# Altium project RightHand.PrjPcb (part 2 of 3)
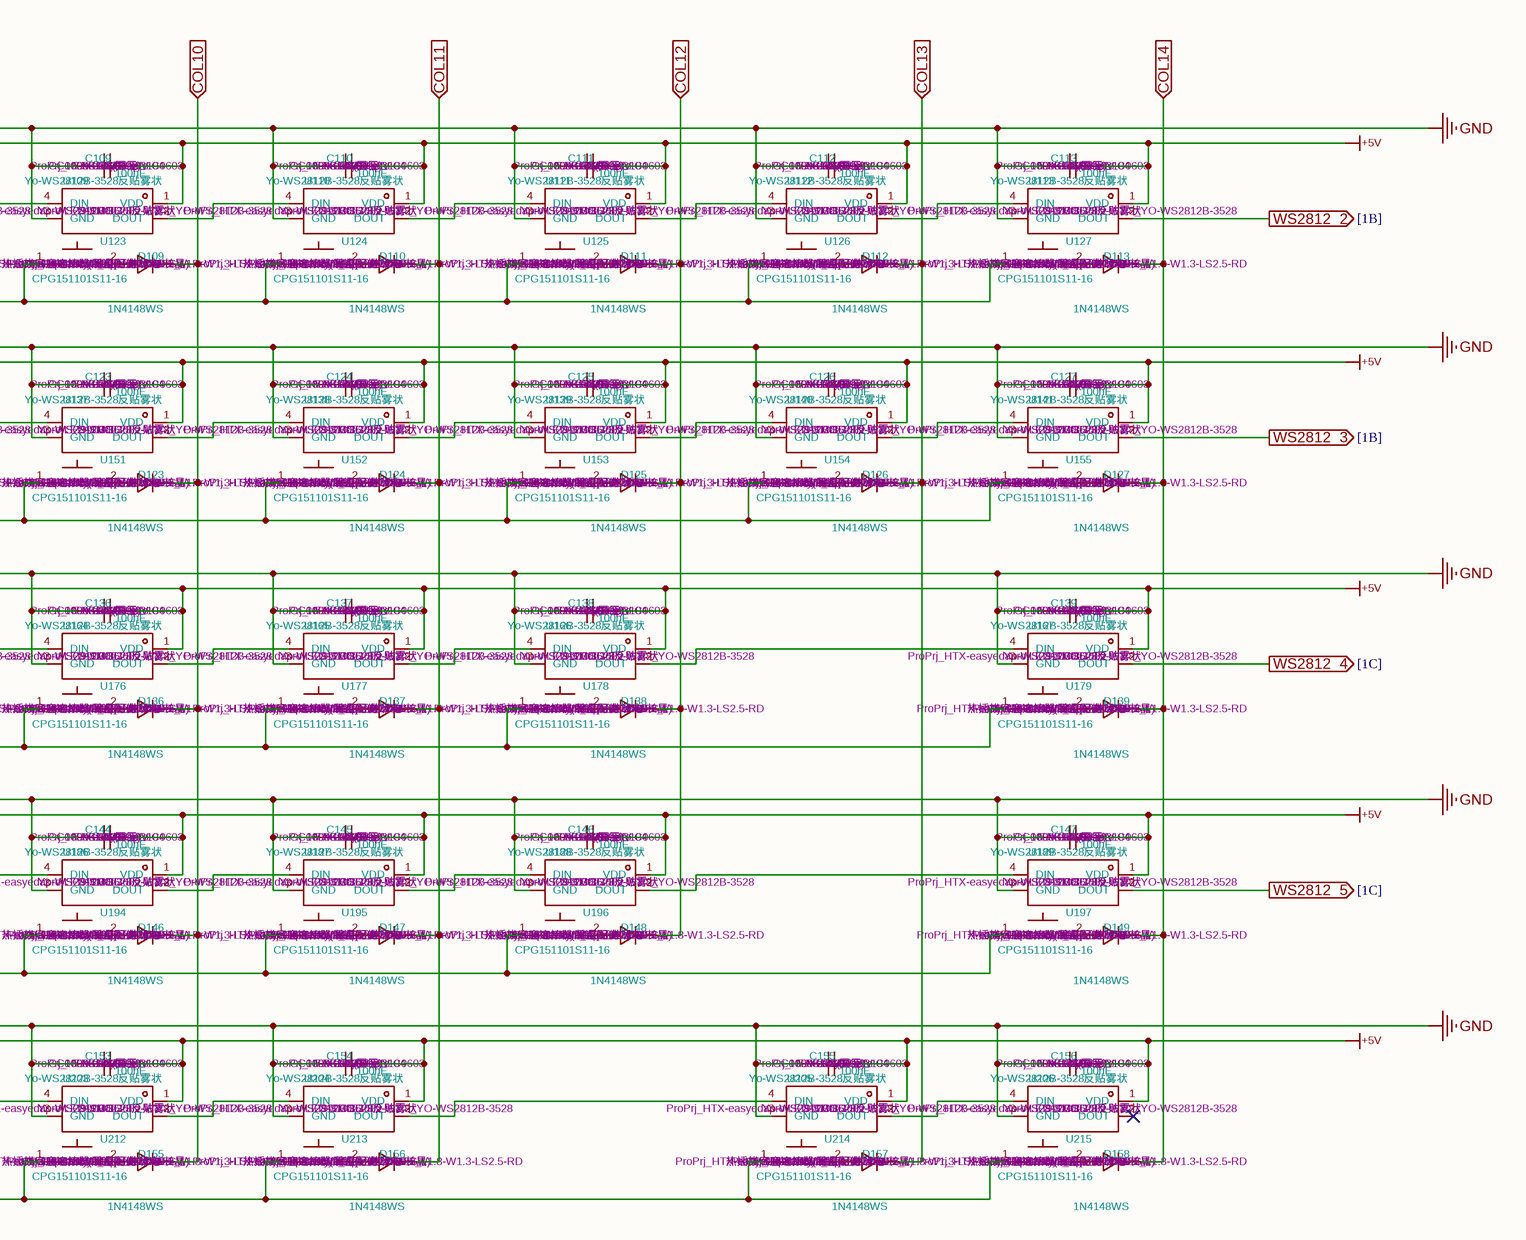
[diagram p10: 2_keys.SchDoc, right]

## Sheet 2_keys.SchDoc (continued)

### Parts
C100  Manufacturer: YAGEO(国巨)  Supplier Part: C14663  Supplier: LCSC  LCSC Part Name: 100nF ±10% 50V  Footprint: ProPrj_HTX-easyedapro:C0603  [C0603]  (hidden comment: 100nF)
C101  Manufacturer: YAGEO(国巨)  Supplier Part: C14663  Supplier: LCSC  LCSC Part Name: 100nF ±10% 50V  Footprint: ProPrj_HTX-easyedapro:C0603  [C0603]  (hidden comment: 100nF)
C102  Manufacturer: YAGEO(国巨)  Supplier Part: C14663  Supplier: LCSC  LCSC Part Name: 100nF ±10% 50V  Footprint: ProPrj_HTX-easyedapro:C0603  [C0603]  (hidden comment: 100nF)
C103  Manufacturer: YAGEO(国巨)  Supplier Part: C14663  Supplier: LCSC  LCSC Part Name: 100nF ±10% 50V  Footprint: ProPrj_HTX-easyedapro:C0603  [C0603]  (hidden comment: 100nF)
C104  Manufacturer: YAGEO(国巨)  Supplier Part: C14663  Supplier: LCSC  LCSC Part Name: 100nF ±10% 50V  Footprint: ProPrj_HTX-easyedapro:C0603  [C0603]  (hidden comment: 100nF)
C105  Manufacturer: YAGEO(国巨)  Supplier Part: C14663  Supplier: LCSC  LCSC Part Name: 100nF ±10% 50V  Footprint: ProPrj_HTX-easyedapro:C0603  [C0603]  (hidden comment: 100nF)
C106  Manufacturer: YAGEO(国巨)  Supplier Part: C14663  Supplier: LCSC  LCSC Part Name: 100nF ±10% 50V  Footprint: ProPrj_HTX-easyedapro:C0603  [C0603]  (hidden comment: 100nF)
C107  Manufacturer: YAGEO(国巨)  Supplier Part: C14663  Supplier: LCSC  LCSC Part Name: 100nF ±10% 50V  Footprint: ProPrj_HTX-easyedapro:C0603  [C0603]  (hidden comment: 100nF)
C108  Manufacturer: YAGEO(国巨)  Supplier Part: C14663  Supplier: LCSC  LCSC Part Name: 100nF ±10% 50V  Footprint: ProPrj_HTX-easyedapro:C0603  [C0603]  (hidden comment: 100nF)
C109  Manufacturer: YAGEO(国巨)  Supplier Part: C14663  Supplier: LCSC  LCSC Part Name: 100nF ±10% 50V  Footprint: ProPrj_HTX-easyedapro:C0603  [C0603]  (hidden comment: 100nF)
C110  Manufacturer: YAGEO(国巨)  Supplier Part: C14663  Supplier: LCSC  LCSC Part Name: 100nF ±10% 50V  Footprint: ProPrj_HTX-easyedapro:C0603  [C0603]  (hidden comment: 100nF)
C111  Manufacturer: YAGEO(国巨)  Supplier Part: C14663  Supplier: LCSC  LCSC Part Name: 100nF ±10% 50V  Footprint: ProPrj_HTX-easyedapro:C0603  [C0603]  (hidden comment: 100nF)
C112  Manufacturer: YAGEO(国巨)  Supplier Part: C14663  Supplier: LCSC  LCSC Part Name: 100nF ±10% 50V  Footprint: ProPrj_HTX-easyedapro:C0603  [C0603]  (hidden comment: 100nF)
C113  Manufacturer: YAGEO(国巨)  Supplier Part: C14663  Supplier: LCSC  LCSC Part Name: 100nF ±10% 50V  Footprint: ProPrj_HTX-easyedapro:C0603  [C0603]  (hidden comment: 100nF)
C114  Manufacturer: YAGEO(国巨)  Supplier Part: C14663  Supplier: LCSC  LCSC Part Name: 100nF ±10% 50V  Footprint: ProPrj_HTX-easyedapro:C0603  [C0603]  (hidden comment: 100nF)
C115  Manufacturer: YAGEO(国巨)  Supplier Part: C14663  Supplier: LCSC  LCSC Part Name: 100nF ±10% 50V  Footprint: ProPrj_HTX-easyedapro:C0603  [C0603]  (hidden comment: 100nF)
C116  Manufacturer: YAGEO(国巨)  Supplier Part: C14663  Supplier: LCSC  LCSC Part Name: 100nF ±10% 50V  Footprint: ProPrj_HTX-easyedapro:C0603  [C0603]  (hidden comment: 100nF)
C117  Manufacturer: YAGEO(国巨)  Supplier Part: C14663  Supplier: LCSC  LCSC Part Name: 100nF ±10% 50V  Footprint: ProPrj_HTX-easyedapro:C0603  [C0603]  (hidden comment: 100nF)
C118  Manufacturer: YAGEO(国巨)  Supplier Part: C14663  Supplier: LCSC  LCSC Part Name: 100nF ±10% 50V  Footprint: ProPrj_HTX-easyedapro:C0603  [C0603]  (hidden comment: 100nF)
C119  Manufacturer: YAGEO(国巨)  Supplier Part: C14663  Supplier: LCSC  LCSC Part Name: 100nF ±10% 50V  Footprint: ProPrj_HTX-easyedapro:C0603  [C0603]  (hidden comment: 100nF)
C120  Manufacturer: YAGEO(国巨)  Supplier Part: C14663  Supplier: LCSC  LCSC Part Name: 100nF ±10% 50V  Footprint: ProPrj_HTX-easyedapro:C0603  [C0603]  (hidden comment: 100nF)
C121  Manufacturer: YAGEO(国巨)  Supplier Part: C14663  Supplier: LCSC  LCSC Part Name: 100nF ±10% 50V  Footprint: ProPrj_HTX-easyedapro:C0603  [C0603]  (hidden comment: 100nF)
C122  Manufacturer: YAGEO(国巨)  Supplier Part: C14663  Supplier: LCSC  LCSC Part Name: 100nF ±10% 50V  Footprint: ProPrj_HTX-easyedapro:C0603  [C0603]  (hidden comment: 100nF)
C123  Manufacturer: YAGEO(国巨)  Supplier Part: C14663  Supplier: LCSC  LCSC Part Name: 100nF ±10% 50V  Footprint: ProPrj_HTX-easyedapro:C0603  [C0603]  (hidden comment: 100nF)
C124  Manufacturer: YAGEO(国巨)  Supplier Part: C14663  Supplier: LCSC  LCSC Part Name: 100nF ±10% 50V  Footprint: ProPrj_HTX-easyedapro:C0603  [C0603]  (hidden comment: 100nF)
C125  Manufacturer: YAGEO(国巨)  Supplier Part: C14663  Supplier: LCSC  LCSC Part Name: 100nF ±10% 50V  Footprint: ProPrj_HTX-easyedapro:C0603  [C0603]  (hidden comment: 100nF)
C126  Manufacturer: YAGEO(国巨)  Supplier Part: C14663  Supplier: LCSC  LCSC Part Name: 100nF ±10% 50V  Footprint: ProPrj_HTX-easyedapro:C0603  [C0603]  (hidden comment: 100nF)
C127  Manufacturer: YAGEO(国巨)  Supplier Part: C14663  Supplier: LCSC  LCSC Part Name: 100nF ±10% 50V  Footprint: ProPrj_HTX-easyedapro:C0603  [C0603]  (hidden comment: 100nF)
C128  Manufacturer: YAGEO(国巨)  Supplier Part: C14663  Supplier: LCSC  LCSC Part Name: 100nF ±10% 50V  Footprint: ProPrj_HTX-easyedapro:C0603  [C0603]  (hidden comment: 100nF)
C129  Manufacturer: YAGEO(国巨)  Supplier Part: C14663  Supplier: LCSC  LCSC Part Name: 100nF ±10% 50V  Footprint: ProPrj_HTX-easyedapro:C0603  [C0603]  (hidden comment: 100nF)
C130  Manufacturer: YAGEO(国巨)  Supplier Part: C14663  Supplier: LCSC  LCSC Part Name: 100nF ±10% 50V  Footprint: ProPrj_HTX-easyedapro:C0603  [C0603]  (hidden comment: 100nF)
C131  Manufacturer: YAGEO(国巨)  Supplier Part: C14663  Supplier: LCSC  LCSC Part Name: 100nF ±10% 50V  Footprint: ProPrj_HTX-easyedapro:C0603  [C0603]  (hidden comment: 100nF)
C132  Manufacturer: YAGEO(国巨)  Supplier Part: C14663  Supplier: LCSC  LCSC Part Name: 100nF ±10% 50V  Footprint: ProPrj_HTX-easyedapro:C0603  [C0603]  (hidden comment: 100nF)
C133  Manufacturer: YAGEO(国巨)  Supplier Part: C14663  Supplier: LCSC  LCSC Part Name: 100nF ±10% 50V  Footprint: ProPrj_HTX-easyedapro:C0603  [C0603]  (hidden comment: 100nF)
C134  Manufacturer: YAGEO(国巨)  Supplier Part: C14663  Supplier: LCSC  LCSC Part Name: 100nF ±10% 50V  Footprint: ProPrj_HTX-easyedapro:C0603  [C0603]  (hidden comment: 100nF)
C135  Manufacturer: YAGEO(国巨)  Supplier Part: C14663  Supplier: LCSC  LCSC Part Name: 100nF ±10% 50V  Footprint: ProPrj_HTX-easyedapro:C0603  [C0603]  (hidden comment: 100nF)
C136  Manufacturer: YAGEO(国巨)  Supplier Part: C14663  Supplier: LCSC  LCSC Part Name: 100nF ±10% 50V  Footprint: ProPrj_HTX-easyedapro:C0603  [C0603]  (hidden comment: 100nF)
C137  Manufacturer: YAGEO(国巨)  Supplier Part: C14663  Supplier: LCSC  LCSC Part Name: 100nF ±10% 50V  Footprint: ProPrj_HTX-easyedapro:C0603  [C0603]  (hidden comment: 100nF)
C138  Manufacturer: YAGEO(国巨)  Supplier Part: C14663  Supplier: LCSC  LCSC Part Name: 100nF ±10% 50V  Footprint: ProPrj_HTX-easyedapro:C0603  [C0603]  (hidden comment: 100nF)
C139  Manufacturer: YAGEO(国巨)  Supplier Part: C14663  Supplier: LCSC  LCSC Part Name: 100nF ±10% 50V  Footprint: ProPrj_HTX-easyedapro:C0603  [C0603]  (hidden comment: 100nF)
C140  Manufacturer: YAGEO(国巨)  Supplier Part: C14663  Supplier: LCSC  LCSC Part Name: 100nF ±10% 50V  Footprint: ProPrj_HTX-easyedapro:C0603  [C0603]  (hidden comment: 100nF)
C141  Manufacturer: YAGEO(国巨)  Supplier Part: C14663  Supplier: LCSC  LCSC Part Name: 100nF ±10% 50V  Footprint: ProPrj_HTX-easyedapro:C0603  [C0603]  (hidden comment: 100nF)
C142  Manufacturer: YAGEO(国巨)  Supplier Part: C14663  Supplier: LCSC  LCSC Part Name: 100nF ±10% 50V  Footprint: ProPrj_HTX-easyedapro:C0603  [C0603]  (hidden comment: 100nF)
C143  Manufacturer: YAGEO(国巨)  Supplier Part: C14663  Supplier: LCSC  LCSC Part Name: 100nF ±10% 50V  Footprint: ProPrj_HTX-easyedapro:C0603  [C0603]  (hidden comment: 100nF)
C144  Manufacturer: YAGEO(国巨)  Supplier Part: C14663  Supplier: LCSC  LCSC Part Name: 100nF ±10% 50V  Footprint: ProPrj_HTX-easyedapro:C0603  [C0603]  (hidden comment: 100nF)
C145  Manufacturer: YAGEO(国巨)  Supplier Part: C14663  Supplier: LCSC  LCSC Part Name: 100nF ±10% 50V  Footprint: ProPrj_HTX-easyedapro:C0603  [C0603]  (hidden comment: 100nF)
C146  Manufacturer: YAGEO(国巨)  Supplier Part: C14663  Supplier: LCSC  LCSC Part Name: 100nF ±10% 50V  Footprint: ProPrj_HTX-easyedapro:C0603  [C0603]  (hidden comment: 100nF)
C147  Manufacturer: YAGEO(国巨)  Supplier Part: C14663  Supplier: LCSC  LCSC Part Name: 100nF ±10% 50V  Footprint: ProPrj_HTX-easyedapro:C0603  [C0603]  (hidden comment: 100nF)
C148  Manufacturer: YAGEO(国巨)  Supplier Part: C14663  Supplier: LCSC  LCSC Part Name: 100nF ±10% 50V  Footprint: ProPrj_HTX-easyedapro:C0603  [C0603]  (hidden comment: 100nF)
C149  Manufacturer: YAGEO(国巨)  Supplier Part: C14663  Supplier: LCSC  LCSC Part Name: 100nF ±10% 50V  Footprint: ProPrj_HTX-easyedapro:C0603  [C0603]  (hidden comment: 100nF)
C150  Manufacturer: YAGEO(国巨)  Supplier Part: C14663  Supplier: LCSC  LCSC Part Name: 100nF ±10% 50V  Footprint: ProPrj_HTX-easyedapro:C0603  [C0603]  (hidden comment: 100nF)
C151  Manufacturer: YAGEO(国巨)  Supplier Part: C14663  Supplier: LCSC  LCSC Part Name: 100nF ±10% 50V  Footprint: ProPrj_HTX-easyedapro:C0603  [C0603]  (hidden comment: 100nF)
C152  Manufacturer: YAGEO(国巨)  Supplier Part: C14663  Supplier: LCSC  LCSC Part Name: 100nF ±10% 50V  Footprint: ProPrj_HTX-easyedapro:C0603  [C0603]  (hidden comment: 100nF)
C153  Manufacturer: YAGEO(国巨)  Supplier Part: C14663  Supplier: LCSC  LCSC Part Name: 100nF ±10% 50V  Footprint: ProPrj_HTX-easyedapro:C0603  [C0603]  (hidden comment: 100nF)
C154  Manufacturer: YAGEO(国巨)  Supplier Part: C14663  Supplier: LCSC  LCSC Part Name: 100nF ±10% 50V  Footprint: ProPrj_HTX-easyedapro:C0603  [C0603]  (hidden comment: 100nF)
C155  Manufacturer: YAGEO(国巨)  Supplier Part: C14663  Supplier: LCSC  LCSC Part Name: 100nF ±10% 50V  Footprint: ProPrj_HTX-easyedapro:C0603  [C0603]  (hidden comment: 100nF)
C156  Manufacturer: YAGEO(国巨)  Supplier Part: C14663  Supplier: LCSC  LCSC Part Name: 100nF ±10% 50V  Footprint: ProPrj_HTX-easyedapro:C0603  [C0603]  (hidden comment: 100nF)
D100  Manufacturer: CJ(江苏长电/长晶)  Supplier Part: C2128  Supplier: LCSC  LCSC Part Name: 丝印T4  Footprint: ProPrj_HTX-easyedapro:SOD-323_L1.8-W1.3-LS2.5-RD  [SOD-323_L1.8-W1.3-LS2.5-RD]  (hidden comment: 1N4148WS)
D101  Manufacturer: CJ(江苏长电/长晶)  Supplier Part: C2128  Supplier: LCSC  LCSC Part Name: 丝印T4  Footprint: ProPrj_HTX-easyedapro:SOD-323_L1.8-W1.3-LS2.5-RD  [SOD-323_L1.8-W1.3-LS2.5-RD]  (hidden comment: 1N4148WS)
D102  Manufacturer: CJ(江苏长电/长晶)  Supplier Part: C2128  Supplier: LCSC  LCSC Part Name: 丝印T4  Footprint: ProPrj_HTX-easyedapro:SOD-323_L1.8-W1.3-LS2.5-RD  [SOD-323_L1.8-W1.3-LS2.5-RD]  (hidden comment: 1N4148WS)
D103  Manufacturer: CJ(江苏长电/长晶)  Supplier Part: C2128  Supplier: LCSC  LCSC Part Name: 丝印T4  Footprint: ProPrj_HTX-easyedapro:SOD-323_L1.8-W1.3-LS2.5-RD  [SOD-323_L1.8-W1.3-LS2.5-RD]  (hidden comment: 1N4148WS)
D104  Manufacturer: CJ(江苏长电/长晶)  Supplier Part: C2128  Supplier: LCSC  LCSC Part Name: 丝印T4  Footprint: ProPrj_HTX-easyedapro:SOD-323_L1.8-W1.3-LS2.5-RD  [SOD-323_L1.8-W1.3-LS2.5-RD]  (hidden comment: 1N4148WS)
D105  Manufacturer: CJ(江苏长电/长晶)  Supplier Part: C2128  Supplier: LCSC  LCSC Part Name: 丝印T4  Footprint: ProPrj_HTX-easyedapro:SOD-323_L1.8-W1.3-LS2.5-RD  [SOD-323_L1.8-W1.3-LS2.5-RD]  (hidden comment: 1N4148WS)
D106  Manufacturer: CJ(江苏长电/长晶)  Supplier Part: C2128  Supplier: LCSC  LCSC Part Name: 丝印T4  Footprint: ProPrj_HTX-easyedapro:SOD-323_L1.8-W1.3-LS2.5-RD  [SOD-323_L1.8-W1.3-LS2.5-RD]  (hidden comment: 1N4148WS)
D107  Manufacturer: CJ(江苏长电/长晶)  Supplier Part: C2128  Supplier: LCSC  LCSC Part Name: 丝印T4  Footprint: ProPrj_HTX-easyedapro:SOD-323_L1.8-W1.3-LS2.5-RD  [SOD-323_L1.8-W1.3-LS2.5-RD]  (hidden comment: 1N4148WS)
D108  Manufacturer: CJ(江苏长电/长晶)  Supplier Part: C2128  Supplier: LCSC  LCSC Part Name: 丝印T4  Footprint: ProPrj_HTX-easyedapro:SOD-323_L1.8-W1.3-LS2.5-RD  [SOD-323_L1.8-W1.3-LS2.5-RD]  (hidden comment: 1N4148WS)
D109  Manufacturer: CJ(江苏长电/长晶)  Supplier Part: C2128  Supplier: LCSC  LCSC Part Name: 丝印T4  Footprint: ProPrj_HTX-easyedapro:SOD-323_L1.8-W1.3-LS2.5-RD  [SOD-323_L1.8-W1.3-LS2.5-RD]  (hidden comment: 1N4148WS)
D110  Manufacturer: CJ(江苏长电/长晶)  Supplier Part: C2128  Supplier: LCSC  LCSC Part Name: 丝印T4  Footprint: ProPrj_HTX-easyedapro:SOD-323_L1.8-W1.3-LS2.5-RD  [SOD-323_L1.8-W1.3-LS2.5-RD]  (hidden comment: 1N4148WS)
D111  Manufacturer: CJ(江苏长电/长晶)  Supplier Part: C2128  Supplier: LCSC  LCSC Part Name: 丝印T4  Footprint: ProPrj_HTX-easyedapro:SOD-323_L1.8-W1.3-LS2.5-RD  [SOD-323_L1.8-W1.3-LS2.5-RD]  (hidden comment: 1N4148WS)
D112  Manufacturer: CJ(江苏长电/长晶)  Supplier Part: C2128  Supplier: LCSC  LCSC Part Name: 丝印T4  Footprint: ProPrj_HTX-easyedapro:SOD-323_L1.8-W1.3-LS2.5-RD  [SOD-323_L1.8-W1.3-LS2.5-RD]  (hidden comment: 1N4148WS)
D113  Manufacturer: CJ(江苏长电/长晶)  Supplier Part: C2128  Supplier: LCSC  LCSC Part Name: 丝印T4  Footprint: ProPrj_HTX-easyedapro:SOD-323_L1.8-W1.3-LS2.5-RD  [SOD-323_L1.8-W1.3-LS2.5-RD]  (hidden comment: 1N4148WS)
D114  Manufacturer: CJ(江苏长电/长晶)  Supplier Part: C2128  Supplier: LCSC  LCSC Part Name: 丝印T4  Footprint: ProPrj_HTX-easyedapro:SOD-323_L1.8-W1.3-LS2.5-RD  [SOD-323_L1.8-W1.3-LS2.5-RD]  (hidden comment: 1N4148WS)
D115  Manufacturer: CJ(江苏长电/长晶)  Supplier Part: C2128  Supplier: LCSC  LCSC Part Name: 丝印T4  Footprint: ProPrj_HTX-easyedapro:SOD-323_L1.8-W1.3-LS2.5-RD  [SOD-323_L1.8-W1.3-LS2.5-RD]  (hidden comment: 1N4148WS)
D116  Manufacturer: CJ(江苏长电/长晶)  Supplier Part: C2128  Supplier: LCSC  LCSC Part Name: 丝印T4  Footprint: ProPrj_HTX-easyedapro:SOD-323_L1.8-W1.3-LS2.5-RD  [SOD-323_L1.8-W1.3-LS2.5-RD]  (hidden comment: 1N4148WS)
D117  Manufacturer: CJ(江苏长电/长晶)  Supplier Part: C2128  Supplier: LCSC  LCSC Part Name: 丝印T4  Footprint: ProPrj_HTX-easyedapro:SOD-323_L1.8-W1.3-LS2.5-RD  [SOD-323_L1.8-W1.3-LS2.5-RD]  (hidden comment: 1N4148WS)
D118  Manufacturer: CJ(江苏长电/长晶)  Supplier Part: C2128  Supplier: LCSC  LCSC Part Name: 丝印T4  Footprint: ProPrj_HTX-easyedapro:SOD-323_L1.8-W1.3-LS2.5-RD  [SOD-323_L1.8-W1.3-LS2.5-RD]  (hidden comment: 1N4148WS)
D119  Manufacturer: CJ(江苏长电/长晶)  Supplier Part: C2128  Supplier: LCSC  LCSC Part Name: 丝印T4  Footprint: ProPrj_HTX-easyedapro:SOD-323_L1.8-W1.3-LS2.5-RD  [SOD-323_L1.8-W1.3-LS2.5-RD]  (hidden comment: 1N4148WS)
D120  Manufacturer: CJ(江苏长电/长晶)  Supplier Part: C2128  Supplier: LCSC  LCSC Part Name: 丝印T4  Footprint: ProPrj_HTX-easyedapro:SOD-323_L1.8-W1.3-LS2.5-RD  [SOD-323_L1.8-W1.3-LS2.5-RD]  (hidden comment: 1N4148WS)
D121  Manufacturer: CJ(江苏长电/长晶)  Supplier Part: C2128  Supplier: LCSC  LCSC Part Name: 丝印T4  Footprint: ProPrj_HTX-easyedapro:SOD-323_L1.8-W1.3-LS2.5-RD  [SOD-323_L1.8-W1.3-LS2.5-RD]  (hidden comment: 1N4148WS)
D122  Manufacturer: CJ(江苏长电/长晶)  Supplier Part: C2128  Supplier: LCSC  LCSC Part Name: 丝印T4  Footprint: ProPrj_HTX-easyedapro:SOD-323_L1.8-W1.3-LS2.5-RD  [SOD-323_L1.8-W1.3-LS2.5-RD]  (hidden comment: 1N4148WS)
D123  Manufacturer: CJ(江苏长电/长晶)  Supplier Part: C2128  Supplier: LCSC  LCSC Part Name: 丝印T4  Footprint: ProPrj_HTX-easyedapro:SOD-323_L1.8-W1.3-LS2.5-RD  [SOD-323_L1.8-W1.3-LS2.5-RD]  (hidden comment: 1N4148WS)
D124  Manufacturer: CJ(江苏长电/长晶)  Supplier Part: C2128  Supplier: LCSC  LCSC Part Name: 丝印T4  Footprint: ProPrj_HTX-easyedapro:SOD-323_L1.8-W1.3-LS2.5-RD  [SOD-323_L1.8-W1.3-LS2.5-RD]  (hidden comment: 1N4148WS)
D125  Manufacturer: CJ(江苏长电/长晶)  Supplier Part: C2128  Supplier: LCSC  LCSC Part Name: 丝印T4  Footprint: ProPrj_HTX-easyedapro:SOD-323_L1.8-W1.3-LS2.5-RD  [SOD-323_L1.8-W1.3-LS2.5-RD]  (hidden comment: 1N4148WS)
D126  Manufacturer: CJ(江苏长电/长晶)  Supplier Part: C2128  Supplier: LCSC  LCSC Part Name: 丝印T4  Footprint: ProPrj_HTX-easyedapro:SOD-323_L1.8-W1.3-LS2.5-RD  [SOD-323_L1.8-W1.3-LS2.5-RD]  (hidden comment: 1N4148WS)
D127  Manufacturer: CJ(江苏长电/长晶)  Supplier Part: C2128  Supplier: LCSC  LCSC Part Name: 丝印T4  Footprint: ProPrj_HTX-easyedapro:SOD-323_L1.8-W1.3-LS2.5-RD  [SOD-323_L1.8-W1.3-LS2.5-RD]  (hidden comment: 1N4148WS)
D128  Manufacturer: CJ(江苏长电/长晶)  Supplier Part: C2128  Supplier: LCSC  LCSC Part Name: 丝印T4  Footprint: ProPrj_HTX-easyedapro:SOD-323_L1.8-W1.3-LS2.5-RD  [SOD-323_L1.8-W1.3-LS2.5-RD]  (hidden comment: 1N4148WS)
D129  Manufacturer: CJ(江苏长电/长晶)  Supplier Part: C2128  Supplier: LCSC  LCSC Part Name: 丝印T4  Footprint: ProPrj_HTX-easyedapro:SOD-323_L1.8-W1.3-LS2.5-RD  [SOD-323_L1.8-W1.3-LS2.5-RD]  (hidden comment: 1N4148WS)
D130  Manufacturer: CJ(江苏长电/长晶)  Supplier Part: C2128  Supplier: LCSC  LCSC Part Name: 丝印T4  Footprint: ProPrj_HTX-easyedapro:SOD-323_L1.8-W1.3-LS2.5-RD  [SOD-323_L1.8-W1.3-LS2.5-RD]  (hidden comment: 1N4148WS)
D131  Manufacturer: CJ(江苏长电/长晶)  Supplier Part: C2128  Supplier: LCSC  LCSC Part Name: 丝印T4  Footprint: ProPrj_HTX-easyedapro:SOD-323_L1.8-W1.3-LS2.5-RD  [SOD-323_L1.8-W1.3-LS2.5-RD]  (hidden comment: 1N4148WS)
D132  Manufacturer: CJ(江苏长电/长晶)  Supplier Part: C2128  Supplier: LCSC  LCSC Part Name: 丝印T4  Footprint: ProPrj_HTX-easyedapro:SOD-323_L1.8-W1.3-LS2.5-RD  [SOD-323_L1.8-W1.3-LS2.5-RD]  (hidden comment: 1N4148WS)
D133  Manufacturer: CJ(江苏长电/长晶)  Supplier Part: C2128  Supplier: LCSC  LCSC Part Name: 丝印T4  Footprint: ProPrj_HTX-easyedapro:SOD-323_L1.8-W1.3-LS2.5-RD  [SOD-323_L1.8-W1.3-LS2.5-RD]  (hidden comment: 1N4148WS)
D134  Manufacturer: CJ(江苏长电/长晶)  Supplier Part: C2128  Supplier: LCSC  LCSC Part Name: 丝印T4  Footprint: ProPrj_HTX-easyedapro:SOD-323_L1.8-W1.3-LS2.5-RD  [SOD-323_L1.8-W1.3-LS2.5-RD]  (hidden comment: 1N4148WS)
D135  Manufacturer: CJ(江苏长电/长晶)  Supplier Part: C2128  Supplier: LCSC  LCSC Part Name: 丝印T4  Footprint: ProPrj_HTX-easyedapro:SOD-323_L1.8-W1.3-LS2.5-RD  [SOD-323_L1.8-W1.3-LS2.5-RD]  (hidden comment: 1N4148WS)
D136  Manufacturer: CJ(江苏长电/长晶)  Supplier Part: C2128  Supplier: LCSC  LCSC Part Name: 丝印T4  Footprint: ProPrj_HTX-easyedapro:SOD-323_L1.8-W1.3-LS2.5-RD  [SOD-323_L1.8-W1.3-LS2.5-RD]  (hidden comment: 1N4148WS)
D137  Manufacturer: CJ(江苏长电/长晶)  Supplier Part: C2128  Supplier: LCSC  LCSC Part Name: 丝印T4  Footprint: ProPrj_HTX-easyedapro:SOD-323_L1.8-W1.3-LS2.5-RD  [SOD-323_L1.8-W1.3-LS2.5-RD]  (hidden comment: 1N4148WS)
D138  Manufacturer: CJ(江苏长电/长晶)  Supplier Part: C2128  Supplier: LCSC  LCSC Part Name: 丝印T4  Footprint: ProPrj_HTX-easyedapro:SOD-323_L1.8-W1.3-LS2.5-RD  [SOD-323_L1.8-W1.3-LS2.5-RD]  (hidden comment: 1N4148WS)
D139  Manufacturer: CJ(江苏长电/长晶)  Supplier Part: C2128  Supplier: LCSC  LCSC Part Name: 丝印T4  Footprint: ProPrj_HTX-easyedapro:SOD-323_L1.8-W1.3-LS2.5-RD  [SOD-323_L1.8-W1.3-LS2.5-RD]  (hidden comment: 1N4148WS)
D140  Manufacturer: MDD(辰达半导体)  Supplier Part: C437156  Supplier: LCSC  LCSC Part Name: 电压:100V 电流:150mA  Footprint: ProPrj_HTX-easyedapro:SOD-323_L1.8-W1.3-LS2.5-RD  [SOD-323_L1.8-W1.3-LS2.5-RD]  (hidden comment: 1N4148WS)
D141  Manufacturer: MDD(辰达半导体)  Supplier Part: C437156  Supplier: LCSC  LCSC Part Name: 电压:100V 电流:150mA  Footprint: ProPrj_HTX-easyedapro:SOD-323_L1.8-W1.3-LS2.5-RD  [SOD-323_L1.8-W1.3-LS2.5-RD]  (hidden comment: 1N4148WS)
D142  Manufacturer: CJ(江苏长电/长晶)  Supplier Part: C2128  Supplier: LCSC  LCSC Part Name: 丝印T4  Footprint: ProPrj_HTX-easyedapro:SOD-323_L1.8-W1.3-LS2.5-RD  [SOD-323_L1.8-W1.3-LS2.5-RD]  (hidden comment: 1N4148WS)
D143  Manufacturer: CJ(江苏长电/长晶)  Supplier Part: C2128  Supplier: LCSC  LCSC Part Name: 丝印T4  Footprint: ProPrj_HTX-easyedapro:SOD-323_L1.8-W1.3-LS2.5-RD  [SOD-323_L1.8-W1.3-LS2.5-RD]  (hidden comment: 1N4148WS)
D144  Manufacturer: CJ(江苏长电/长晶)  Supplier Part: C2128  Supplier: LCSC  LCSC Part Name: 丝印T4  Footprint: ProPrj_HTX-easyedapro:SOD-323_L1.8-W1.3-LS2.5-RD  [SOD-323_L1.8-W1.3-LS2.5-RD]  (hidden comment: 1N4148WS)
D145  Manufacturer: CJ(江苏长电/长晶)  Supplier Part: C2128  Supplier: LCSC  LCSC Part Name: 丝印T4  Footprint: ProPrj_HTX-easyedapro:SOD-323_L1.8-W1.3-LS2.5-RD  [SOD-323_L1.8-W1.3-LS2.5-RD]  (hidden comment: 1N4148WS)
D146  Manufacturer: CJ(江苏长电/长晶)  Supplier Part: C2128  Supplier: LCSC  LCSC Part Name: 丝印T4  Footprint: ProPrj_HTX-easyedapro:SOD-323_L1.8-W1.3-LS2.5-RD  [SOD-323_L1.8-W1.3-LS2.5-RD]  (hidden comment: 1N4148WS)
D147  Manufacturer: CJ(江苏长电/长晶)  Supplier Part: C2128  Supplier: LCSC  LCSC Part Name: 丝印T4  Footprint: ProPrj_HTX-easyedapro:SOD-323_L1.8-W1.3-LS2.5-RD  [SOD-323_L1.8-W1.3-LS2.5-RD]  (hidden comment: 1N4148WS)
D148  Manufacturer: CJ(江苏长电/长晶)  Supplier Part: C2128  Supplier: LCSC  LCSC Part Name: 丝印T4  Footprint: ProPrj_HTX-easyedapro:SOD-323_L1.8-W1.3-LS2.5-RD  [SOD-323_L1.8-W1.3-LS2.5-RD]  (hidden comment: 1N4148WS)
D149  Manufacturer: CJ(江苏长电/长晶)  Supplier Part: C2128  Supplier: LCSC  LCSC Part Name: 丝印T4  Footprint: ProPrj_HTX-easyedapro:SOD-323_L1.8-W1.3-LS2.5-RD  [SOD-323_L1.8-W1.3-LS2.5-RD]  (hidden comment: 1N4148WS)
D150  Manufacturer: CJ(江苏长电/长晶)  Supplier Part: C2128  Supplier: LCSC  LCSC Part Name: 丝印T4  Footprint: ProPrj_HTX-easyedapro:SOD-323_L1.8-W1.3-LS2.5-RD  [SOD-323_L1.8-W1.3-LS2.5-RD]  (hidden comment: 1N4148WS)
D151  Manufacturer: CJ(江苏长电/长晶)  Supplier Part: C2128  Supplier: LCSC  LCSC Part Name: 丝印T4  Footprint: ProPrj_HTX-easyedapro:SOD-323_L1.8-W1.3-LS2.5-RD  [SOD-323_L1.8-W1.3-LS2.5-RD]  (hidden comment: 1N4148WS)
D152  Manufacturer: CJ(江苏长电/长晶)  Supplier Part: C2128  Supplier: LCSC  LCSC Part Name: 丝印T4  Footprint: ProPrj_HTX-easyedapro:SOD-323_L1.8-W1.3-LS2.5-RD  [SOD-323_L1.8-W1.3-LS2.5-RD]  (hidden comment: 1N4148WS)
D153  Manufacturer: CJ(江苏长电/长晶)  Supplier Part: C2128  Supplier: LCSC  LCSC Part Name: 丝印T4  Footprint: ProPrj_HTX-easyedapro:SOD-323_L1.8-W1.3-LS2.5-RD  [SOD-323_L1.8-W1.3-LS2.5-RD]  (hidden comment: 1N4148WS)
D154  Manufacturer: CJ(江苏长电/长晶)  Supplier Part: C2128  Supplier: LCSC  LCSC Part Name: 丝印T4  Footprint: ProPrj_HTX-easyedapro:SOD-323_L1.8-W1.3-LS2.5-RD  [SOD-323_L1.8-W1.3-LS2.5-RD]  (hidden comment: 1N4148WS)
D155  Manufacturer: CJ(江苏长电/长晶)  Supplier Part: C2128  Supplier: LCSC  LCSC Part Name: 丝印T4  Footprint: ProPrj_HTX-easyedapro:SOD-323_L1.8-W1.3-LS2.5-RD  [SOD-323_L1.8-W1.3-LS2.5-RD]  (hidden comment: 1N4148WS)
D156  Manufacturer: CJ(江苏长电/长晶)  Supplier Part: C2128  Supplier: LCSC  LCSC Part Name: 丝印T4  Footprint: ProPrj_HTX-easyedapro:SOD-323_L1.8-W1.3-LS2.5-RD  [SOD-323_L1.8-W1.3-LS2.5-RD]  (hidden comment: 1N4148WS)
D157  Manufacturer: CJ(江苏长电/长晶)  Supplier Part: C2128  Supplier: LCSC  LCSC Part Name: 丝印T4  Footprint: ProPrj_HTX-easyedapro:SOD-323_L1.8-W1.3-LS2.5-RD  [SOD-323_L1.8-W1.3-LS2.5-RD]  (hidden comment: 1N4148WS)
D158  Manufacturer: CJ(江苏长电/长晶)  Supplier Part: C2128  Supplier: LCSC  LCSC Part Name: 丝印T4  Footprint: ProPrj_HTX-easyedapro:SOD-323_L1.8-W1.3-LS2.5-RD  [SOD-323_L1.8-W1.3-LS2.5-RD]  (hidden comment: 1N4148WS)
SW100  Manufacturer: 韩国韩荣  Supplier Part: C107266  Supplier: LCSC  LCSC Part Name: 12.7*5.7*7.5mm 插件微动开关  Footprint: ProPrj_HTX-easyedapro:SW-TH_K9-1267T  [SW-TH_K9-1267T]  (hidden comment: K9-1267T)
SW101  Manufacturer: 韩国韩荣  Supplier Part: C107266  Supplier: LCSC  LCSC Part Name: 12.7*5.7*7.5mm 插件微动开关  Footprint: ProPrj_HTX-easyedapro:SW-TH_K9-1267T  [SW-TH_K9-1267T]  (hidden comment: K9-1267T)
U100  Supplier Part: C9900003682  Supplier: LCSC  Footprint: ProPrj_HTX-easyedapro:LED-SMD_L3.2-W2.8_YO-WS2812B-3528  [LED-SMD_L3.2-W2.8_YO-WS2812B-3528]  (hidden comment: Yo-WS2812B-3528反贴雾状)
U101  Supplier Part: C9900003682  Supplier: LCSC  Footprint: ProPrj_HTX-easyedapro:LED-SMD_L3.2-W2.8_YO-WS2812B-3528  [LED-SMD_L3.2-W2.8_YO-WS2812B-3528]  (hidden comment: Yo-WS2812B-3528反贴雾状)
U102  Supplier Part: C9900003682  Supplier: LCSC  Footprint: ProPrj_HTX-easyedapro:LED-SMD_L3.2-W2.8_YO-WS2812B-3528  [LED-SMD_L3.2-W2.8_YO-WS2812B-3528]  (hidden comment: Yo-WS2812B-3528反贴雾状)
U103  Supplier Part: C9900003682  Supplier: LCSC  Footprint: ProPrj_HTX-easyedapro:LED-SMD_L3.2-W2.8_YO-WS2812B-3528  [LED-SMD_L3.2-W2.8_YO-WS2812B-3528]  (hidden comment: Yo-WS2812B-3528反贴雾状)
U104  Supplier Part: C9900003682  Supplier: LCSC  Footprint: ProPrj_HTX-easyedapro:LED-SMD_L3.2-W2.8_YO-WS2812B-3528  [LED-SMD_L3.2-W2.8_YO-WS2812B-3528]  (hidden comment: Yo-WS2812B-3528反贴雾状)
U105  Supplier Part: C9900003682  Supplier: LCSC  Footprint: ProPrj_HTX-easyedapro:LED-SMD_L3.2-W2.8_YO-WS2812B-3528  [LED-SMD_L3.2-W2.8_YO-WS2812B-3528]  (hidden comment: Yo-WS2812B-3528反贴雾状)
U106  Supplier Part: C9900003682  Supplier: LCSC  Footprint: ProPrj_HTX-easyedapro:LED-SMD_L3.2-W2.8_YO-WS2812B-3528  [LED-SMD_L3.2-W2.8_YO-WS2812B-3528]  (hidden comment: Yo-WS2812B-3528反贴雾状)
U107  Supplier Part: C9900003682  Supplier: LCSC  Footprint: ProPrj_HTX-easyedapro:LED-SMD_L3.2-W2.8_YO-WS2812B-3528  [LED-SMD_L3.2-W2.8_YO-WS2812B-3528]  (hidden comment: Yo-WS2812B-3528反贴雾状)
U108  Supplier Part: C9900003682  Supplier: LCSC  Footprint: ProPrj_HTX-easyedapro:LED-SMD_L3.2-W2.8_YO-WS2812B-3528  [LED-SMD_L3.2-W2.8_YO-WS2812B-3528]  (hidden comment: Yo-WS2812B-3528反贴雾状)
U109  Supplier Part: C9900003682  Supplier: LCSC  Footprint: ProPrj_HTX-easyedapro:LED-SMD_L3.2-W2.8_YO-WS2812B-3528  [LED-SMD_L3.2-W2.8_YO-WS2812B-3528]  (hidden comment: Yo-WS2812B-3528反贴雾状)
U110  Supplier Part: C9900003682  Supplier: LCSC  Footprint: ProPrj_HTX-easyedapro:LED-SMD_L3.2-W2.8_YO-WS2812B-3528  [LED-SMD_L3.2-W2.8_YO-WS2812B-3528]  (hidden comment: Yo-WS2812B-3528反贴雾状)
U111  Supplier Part: C9900003682  Supplier: LCSC  Footprint: ProPrj_HTX-easyedapro:LED-SMD_L3.2-W2.8_YO-WS2812B-3528  [LED-SMD_L3.2-W2.8_YO-WS2812B-3528]  (hidden comment: Yo-WS2812B-3528反贴雾状)
U112  Supplier Part: C9900003682  Supplier: LCSC  Footprint: ProPrj_HTX-easyedapro:LED-SMD_L3.2-W2.8_YO-WS2812B-3528  [LED-SMD_L3.2-W2.8_YO-WS2812B-3528]  (hidden comment: Yo-WS2812B-3528反贴雾状)
U113  Supplier Part: C9900003682  Supplier: LCSC  Footprint: ProPrj_HTX-easyedapro:LED-SMD_L3.2-W2.8_YO-WS2812B-3528  [LED-SMD_L3.2-W2.8_YO-WS2812B-3528]  (hidden comment: Yo-WS2812B-3528反贴雾状)
U114  Manufacturer: HanElectricity(瀚源)  Supplier Part: C41430893  Supplier: LCSC  LCSC Part Name: 热插拔底座连接器 键盘配件  Footprint: ProPrj_HTX-easyedapro:SMD_KEYBOARD-SW  [SMD_KEYBOARD-SW]  (hidden comment: CPG151101S11-16)
U115  Manufacturer: HanElectricity(瀚源)  Supplier Part: C41430893  Supplier: LCSC  LCSC Part Name: 热插拔底座连接器 键盘配件  Footprint: ProPrj_HTX-easyedapro:SMD_KEYBOARD-SW  [SMD_KEYBOARD-SW]  (hidden comment: CPG151101S11-16)
U116  Manufacturer: HanElectricity(瀚源)  Supplier Part: C41430893  Supplier: LCSC  LCSC Part Name: 热插拔底座连接器 键盘配件  Footprint: ProPrj_HTX-easyedapro:SMD_KEYBOARD-SW  [SMD_KEYBOARD-SW]  (hidden comment: CPG151101S11-16)
U117  Manufacturer: HanElectricity(瀚源)  Supplier Part: C41430893  Supplier: LCSC  LCSC Part Name: 热插拔底座连接器 键盘配件  Footprint: ProPrj_HTX-easyedapro:SMD_KEYBOARD-SW  [SMD_KEYBOARD-SW]  (hidden comment: CPG151101S11-16)
U118  Manufacturer: HanElectricity(瀚源)  Supplier Part: C41430893  Supplier: LCSC  LCSC Part Name: 热插拔底座连接器 键盘配件  Footprint: ProPrj_HTX-easyedapro:SMD_KEYBOARD-SW  [SMD_KEYBOARD-SW]  (hidden comment: CPG151101S11-16)
U119  Manufacturer: HanElectricity(瀚源)  Supplier Part: C41430893  Supplier: LCSC  LCSC Part Name: 热插拔底座连接器 键盘配件  Footprint: ProPrj_HTX-easyedapro:SMD_KEYBOARD-SW  [SMD_KEYBOARD-SW]  (hidden comment: CPG151101S11-16)
U120  Manufacturer: HanElectricity(瀚源)  Supplier Part: C41430893  Supplier: LCSC  LCSC Part Name: 热插拔底座连接器 键盘配件  Footprint: ProPrj_HTX-easyedapro:SMD_KEYBOARD-SW  [SMD_KEYBOARD-SW]  (hidden comment: CPG151101S11-16)
U121  Manufacturer: HanElectricity(瀚源)  Supplier Part: C41430893  Supplier: LCSC  LCSC Part Name: 热插拔底座连接器 键盘配件  Footprint: ProPrj_HTX-easyedapro:SMD_KEYBOARD-SW  [SMD_KEYBOARD-SW]  (hidden comment: CPG151101S11-16)
U122  Manufacturer: HanElectricity(瀚源)  Supplier Part: C41430893  Supplier: LCSC  LCSC Part Name: 热插拔底座连接器 键盘配件  Footprint: ProPrj_HTX-easyedapro:SMD_KEYBOARD-SW  [SMD_KEYBOARD-SW]  (hidden comment: CPG151101S11-16)
U123  Manufacturer: HanElectricity(瀚源)  Supplier Part: C41430893  Supplier: LCSC  LCSC Part Name: 热插拔底座连接器 键盘配件  Footprint: ProPrj_HTX-easyedapro:SMD_KEYBOARD-SW  [SMD_KEYBOARD-SW]  (hidden comment: CPG151101S11-16)
U124  Manufacturer: HanElectricity(瀚源)  Supplier Part: C41430893  Supplier: LCSC  LCSC Part Name: 热插拔底座连接器 键盘配件  Footprint: ProPrj_HTX-easyedapro:SMD_KEYBOARD-SW  [SMD_KEYBOARD-SW]  (hidden comment: CPG151101S11-16)
U125  Manufacturer: HanElectricity(瀚源)  Supplier Part: C41430893  Supplier: LCSC  LCSC Part Name: 热插拔底座连接器 键盘配件  Footprint: ProPrj_HTX-easyedapro:SMD_KEYBOARD-SW  [SMD_KEYBOARD-SW]  (hidden comment: CPG151101S11-16)
U126  Manufacturer: HanElectricity(瀚源)  Supplier Part: C41430893  Supplier: LCSC  LCSC Part Name: 热插拔底座连接器 键盘配件  Footprint: ProPrj_HTX-easyedapro:SMD_KEYBOARD-SW  [SMD_KEYBOARD-SW]  (hidden comment: CPG151101S11-16)
U127  Manufacturer: HanElectricity(瀚源)  Supplier Part: C41430893  Supplier: LCSC  LCSC Part Name: 热插拔底座连接器 键盘配件  Footprint: ProPrj_HTX-easyedapro:SMD_KEYBOARD-SW  [SMD_KEYBOARD-SW]  (hidden comment: CPG151101S11-16)
U128  Supplier Part: C9900003682  Supplier: LCSC  Footprint: ProPrj_HTX-easyedapro:LED-SMD_L3.2-W2.8_YO-WS2812B-3528  [LED-SMD_L3.2-W2.8_YO-WS2812B-3528]  (hidden comment: Yo-WS2812B-3528反贴雾状)
U129  Supplier Part: C9900003682  Supplier: LCSC  Footprint: ProPrj_HTX-easyedapro:LED-SMD_L3.2-W2.8_YO-WS2812B-3528  [LED-SMD_L3.2-W2.8_YO-WS2812B-3528]  (hidden comment: Yo-WS2812B-3528反贴雾状)
U130  Supplier Part: C9900003682  Supplier: LCSC  Footprint: ProPrj_HTX-easyedapro:LED-SMD_L3.2-W2.8_YO-WS2812B-3528  [LED-SMD_L3.2-W2.8_YO-WS2812B-3528]  (hidden comment: Yo-WS2812B-3528反贴雾状)
U131  Supplier Part: C9900003682  Supplier: LCSC  Footprint: ProPrj_HTX-easyedapro:LED-SMD_L3.2-W2.8_YO-WS2812B-3528  [LED-SMD_L3.2-W2.8_YO-WS2812B-3528]  (hidden comment: Yo-WS2812B-3528反贴雾状)
U132  Supplier Part: C9900003682  Supplier: LCSC  Footprint: ProPrj_HTX-easyedapro:LED-SMD_L3.2-W2.8_YO-WS2812B-3528  [LED-SMD_L3.2-W2.8_YO-WS2812B-3528]  (hidden comment: Yo-WS2812B-3528反贴雾状)
U133  Supplier Part: C9900003682  Supplier: LCSC  Footprint: ProPrj_HTX-easyedapro:LED-SMD_L3.2-W2.8_YO-WS2812B-3528  [LED-SMD_L3.2-W2.8_YO-WS2812B-3528]  (hidden comment: Yo-WS2812B-3528反贴雾状)
U134  Supplier Part: C9900003682  Supplier: LCSC  Footprint: ProPrj_HTX-easyedapro:LED-SMD_L3.2-W2.8_YO-WS2812B-3528  [LED-SMD_L3.2-W2.8_YO-WS2812B-3528]  (hidden comment: Yo-WS2812B-3528反贴雾状)
U135  Supplier Part: C9900003682  Supplier: LCSC  Footprint: ProPrj_HTX-easyedapro:LED-SMD_L3.2-W2.8_YO-WS2812B-3528  [LED-SMD_L3.2-W2.8_YO-WS2812B-3528]  (hidden comment: Yo-WS2812B-3528反贴雾状)
U136  Supplier Part: C9900003682  Supplier: LCSC  Footprint: ProPrj_HTX-easyedapro:LED-SMD_L3.2-W2.8_YO-WS2812B-3528  [LED-SMD_L3.2-W2.8_YO-WS2812B-3528]  (hidden comment: Yo-WS2812B-3528反贴雾状)
U137  Supplier Part: C9900003682  Supplier: LCSC  Footprint: ProPrj_HTX-easyedapro:LED-SMD_L3.2-W2.8_YO-WS2812B-3528  [LED-SMD_L3.2-W2.8_YO-WS2812B-3528]  (hidden comment: Yo-WS2812B-3528反贴雾状)
U138  Supplier Part: C9900003682  Supplier: LCSC  Footprint: ProPrj_HTX-easyedapro:LED-SMD_L3.2-W2.8_YO-WS2812B-3528  [LED-SMD_L3.2-W2.8_YO-WS2812B-3528]  (hidden comment: Yo-WS2812B-3528反贴雾状)
U139  Supplier Part: C9900003682  Supplier: LCSC  Footprint: ProPrj_HTX-easyedapro:LED-SMD_L3.2-W2.8_YO-WS2812B-3528  [LED-SMD_L3.2-W2.8_YO-WS2812B-3528]  (hidden comment: Yo-WS2812B-3528反贴雾状)
U140  Supplier Part: C9900003682  Supplier: LCSC  Footprint: ProPrj_HTX-easyedapro:LED-SMD_L3.2-W2.8_YO-WS2812B-3528  [LED-SMD_L3.2-W2.8_YO-WS2812B-3528]  (hidden comment: Yo-WS2812B-3528反贴雾状)
U141  Supplier Part: C9900003682  Supplier: LCSC  Footprint: ProPrj_HTX-easyedapro:LED-SMD_L3.2-W2.8_YO-WS2812B-3528  [LED-SMD_L3.2-W2.8_YO-WS2812B-3528]  (hidden comment: Yo-WS2812B-3528反贴雾状)
U142  Manufacturer: HanElectricity(瀚源)  Supplier Part: C41430893  Supplier: LCSC  LCSC Part Name: 热插拔底座连接器 键盘配件  Footprint: ProPrj_HTX-easyedapro:SMD_KEYBOARD-SW  [SMD_KEYBOARD-SW]  (hidden comment: CPG151101S11-16)
U143  Manufacturer: HanElectricity(瀚源)  Supplier Part: C41430893  Supplier: LCSC  LCSC Part Name: 热插拔底座连接器 键盘配件  Footprint: ProPrj_HTX-easyedapro:SMD_KEYBOARD-SW  [SMD_KEYBOARD-SW]  (hidden comment: CPG151101S11-16)
U144  Manufacturer: HanElectricity(瀚源)  Supplier Part: C41430893  Supplier: LCSC  LCSC Part Name: 热插拔底座连接器 键盘配件  Footprint: ProPrj_HTX-easyedapro:SMD_KEYBOARD-SW  [SMD_KEYBOARD-SW]  (hidden comment: CPG151101S11-16)
U145  Manufacturer: HanElectricity(瀚源)  Supplier Part: C41430893  Supplier: LCSC  LCSC Part Name: 热插拔底座连接器 键盘配件  Footprint: ProPrj_HTX-easyedapro:SMD_KEYBOARD-SW  [SMD_KEYBOARD-SW]  (hidden comment: CPG151101S11-16)
U146  Manufacturer: HanElectricity(瀚源)  Supplier Part: C41430893  Supplier: LCSC  LCSC Part Name: 热插拔底座连接器 键盘配件  Footprint: ProPrj_HTX-easyedapro:SMD_KEYBOARD-SW  [SMD_KEYBOARD-SW]  (hidden comment: CPG151101S11-16)
U147  Manufacturer: HanElectricity(瀚源)  Supplier Part: C41430893  Supplier: LCSC  LCSC Part Name: 热插拔底座连接器 键盘配件  Footprint: ProPrj_HTX-easyedapro:SMD_KEYBOARD-SW  [SMD_KEYBOARD-SW]  (hidden comment: CPG151101S11-16)
U148  Manufacturer: HanElectricity(瀚源)  Supplier Part: C41430893  Supplier: LCSC  LCSC Part Name: 热插拔底座连接器 键盘配件  Footprint: ProPrj_HTX-easyedapro:SMD_KEYBOARD-SW  [SMD_KEYBOARD-SW]  (hidden comment: CPG151101S11-16)
U149  Manufacturer: HanElectricity(瀚源)  Supplier Part: C41430893  Supplier: LCSC  LCSC Part Name: 热插拔底座连接器 键盘配件  Footprint: ProPrj_HTX-easyedapro:SMD_KEYBOARD-SW  [SMD_KEYBOARD-SW]  (hidden comment: CPG151101S11-16)
U150  Manufacturer: HanElectricity(瀚源)  Supplier Part: C41430893  Supplier: LCSC  LCSC Part Name: 热插拔底座连接器 键盘配件  Footprint: ProPrj_HTX-easyedapro:SMD_KEYBOARD-SW  [SMD_KEYBOARD-SW]  (hidden comment: CPG151101S11-16)
U151  Manufacturer: HanElectricity(瀚源)  Supplier Part: C41430893  Supplier: LCSC  LCSC Part Name: 热插拔底座连接器 键盘配件  Footprint: ProPrj_HTX-easyedapro:SMD_KEYBOARD-SW  [SMD_KEYBOARD-SW]  (hidden comment: CPG151101S11-16)
U152  Manufacturer: HanElectricity(瀚源)  Supplier Part: C41430893  Supplier: LCSC  LCSC Part Name: 热插拔底座连接器 键盘配件  Footprint: ProPrj_HTX-easyedapro:SMD_KEYBOARD-SW  [SMD_KEYBOARD-SW]  (hidden comment: CPG151101S11-16)
U153  Manufacturer: HanElectricity(瀚源)  Supplier Part: C41430893  Supplier: LCSC  LCSC Part Name: 热插拔底座连接器 键盘配件  Footprint: ProPrj_HTX-easyedapro:SMD_KEYBOARD-SW  [SMD_KEYBOARD-SW]  (hidden comment: CPG151101S11-16)
U154  Manufacturer: HanElectricity(瀚源)  Supplier Part: C41430893  Supplier: LCSC  LCSC Part Name: 热插拔底座连接器 键盘配件  Footprint: ProPrj_HTX-easyedapro:SMD_KEYBOARD-SW  [SMD_KEYBOARD-SW]  (hidden comment: CPG151101S11-16)
U155  Manufacturer: HanElectricity(瀚源)  Supplier Part: C41430893  Supplier: LCSC  LCSC Part Name: 热插拔底座连接器 键盘配件  Footprint: ProPrj_HTX-easyedapro:SMD_KEYBOARD-SW  [SMD_KEYBOARD-SW]  (hidden comment: CPG151101S11-16)
U156  Supplier Part: C9900003682  Supplier: LCSC  Footprint: ProPrj_HTX-easyedapro:LED-SMD_L3.2-W2.8_YO-WS2812B-3528  [LED-SMD_L3.2-W2.8_YO-WS2812B-3528]  (hidden comment: Yo-WS2812B-3528反贴雾状)
U157  Supplier Part: C9900003682  Supplier: LCSC  Footprint: ProPrj_HTX-easyedapro:LED-SMD_L3.2-W2.8_YO-WS2812B-3528  [LED-SMD_L3.2-W2.8_YO-WS2812B-3528]  (hidden comment: Yo-WS2812B-3528反贴雾状)
U158  Supplier Part: C9900003682  Supplier: LCSC  Footprint: ProPrj_HTX-easyedapro:LED-SMD_L3.2-W2.8_YO-WS2812B-3528  [LED-SMD_L3.2-W2.8_YO-WS2812B-3528]  (hidden comment: Yo-WS2812B-3528反贴雾状)
U159  Supplier Part: C9900003682  Supplier: LCSC  Footprint: ProPrj_HTX-easyedapro:LED-SMD_L3.2-W2.8_YO-WS2812B-3528  [LED-SMD_L3.2-W2.8_YO-WS2812B-3528]  (hidden comment: Yo-WS2812B-3528反贴雾状)
U160  Supplier Part: C9900003682  Supplier: LCSC  Footprint: ProPrj_HTX-easyedapro:LED-SMD_L3.2-W2.8_YO-WS2812B-3528  [LED-SMD_L3.2-W2.8_YO-WS2812B-3528]  (hidden comment: Yo-WS2812B-3528反贴雾状)
U161  Supplier Part: C9900003682  Supplier: LCSC  Footprint: ProPrj_HTX-easyedapro:LED-SMD_L3.2-W2.8_YO-WS2812B-3528  [LED-SMD_L3.2-W2.8_YO-WS2812B-3528]  (hidden comment: Yo-WS2812B-3528反贴雾状)
U162  Supplier Part: C9900003682  Supplier: LCSC  Footprint: ProPrj_HTX-easyedapro:LED-SMD_L3.2-W2.8_YO-WS2812B-3528  [LED-SMD_L3.2-W2.8_YO-WS2812B-3528]  (hidden comment: Yo-WS2812B-3528反贴雾状)
U163  Supplier Part: C9900003682  Supplier: LCSC  Footprint: ProPrj_HTX-easyedapro:LED-SMD_L3.2-W2.8_YO-WS2812B-3528  [LED-SMD_L3.2-W2.8_YO-WS2812B-3528]  (hidden comment: Yo-WS2812B-3528反贴雾状)
U164  Supplier Part: C9900003682  Supplier: LCSC  Footprint: ProPrj_HTX-easyedapro:LED-SMD_L3.2-W2.8_YO-WS2812B-3528  [LED-SMD_L3.2-W2.8_YO-WS2812B-3528]  (hidden comment: Yo-WS2812B-3528反贴雾状)
U165  Supplier Part: C9900003682  Supplier: LCSC  Footprint: ProPrj_HTX-easyedapro:LED-SMD_L3.2-W2.8_YO-WS2812B-3528  [LED-SMD_L3.2-W2.8_YO-WS2812B-3528]  (hidden comment: Yo-WS2812B-3528反贴雾状)
U166  Supplier Part: C9900003682  Supplier: LCSC  Footprint: ProPrj_HTX-easyedapro:LED-SMD_L3.2-W2.8_YO-WS2812B-3528  [LED-SMD_L3.2-W2.8_YO-WS2812B-3528]  (hidden comment: Yo-WS2812B-3528反贴雾状)
U167  Supplier Part: C9900003682  Supplier: LCSC  Footprint: ProPrj_HTX-easyedapro:LED-SMD_L3.2-W2.8_YO-WS2812B-3528  [LED-SMD_L3.2-W2.8_YO-WS2812B-3528]  (hidden comment: Yo-WS2812B-3528反贴雾状)
U168  Manufacturer: HanElectricity(瀚源)  Supplier Part: C41430893  Supplier: LCSC  LCSC Part Name: 热插拔底座连接器 键盘配件  Footprint: ProPrj_HTX-easyedapro:SMD_KEYBOARD-SW  [SMD_KEYBOARD-SW]  (hidden comment: CPG151101S11-16)
U169  Manufacturer: HanElectricity(瀚源)  Supplier Part: C41430893  Supplier: LCSC  LCSC Part Name: 热插拔底座连接器 键盘配件  Footprint: ProPrj_HTX-easyedapro:SMD_KEYBOARD-SW  [SMD_KEYBOARD-SW]  (hidden comment: CPG151101S11-16)
U170  Manufacturer: HanElectricity(瀚源)  Supplier Part: C41430893  Supplier: LCSC  LCSC Part Name: 热插拔底座连接器 键盘配件  Footprint: ProPrj_HTX-easyedapro:SMD_KEYBOARD-SW  [SMD_KEYBOARD-SW]  (hidden comment: CPG151101S11-16)
U171  Manufacturer: HanElectricity(瀚源)  Supplier Part: C41430893  Supplier: LCSC  LCSC Part Name: 热插拔底座连接器 键盘配件  Footprint: ProPrj_HTX-easyedapro:SMD_KEYBOARD-SW  [SMD_KEYBOARD-SW]  (hidden comment: CPG151101S11-16)
U172  Manufacturer: HanElectricity(瀚源)  Supplier Part: C41430893  Supplier: LCSC  LCSC Part Name: 热插拔底座连接器 键盘配件  Footprint: ProPrj_HTX-easyedapro:SMD_KEYBOARD-SW  [SMD_KEYBOARD-SW]  (hidden comment: CPG151101S11-16)
U173  Manufacturer: HanElectricity(瀚源)  Supplier Part: C41430893  Supplier: LCSC  LCSC Part Name: 热插拔底座连接器 键盘配件  Footprint: ProPrj_HTX-easyedapro:SMD_KEYBOARD-SW  [SMD_KEYBOARD-SW]  (hidden comment: CPG151101S11-16)
U174  Manufacturer: HanElectricity(瀚源)  Supplier Part: C41430893  Supplier: LCSC  LCSC Part Name: 热插拔底座连接器 键盘配件  Footprint: ProPrj_HTX-easyedapro:SMD_KEYBOARD-SW  [SMD_KEYBOARD-SW]  (hidden comment: CPG151101S11-16)
U175  Manufacturer: HanElectricity(瀚源)  Supplier Part: C41430893  Supplier: LCSC  LCSC Part Name: 热插拔底座连接器 键盘配件  Footprint: ProPrj_HTX-easyedapro:SMD_KEYBOARD-SW  [SMD_KEYBOARD-SW]  (hidden comment: CPG151101S11-16)
U176  Manufacturer: HanElectricity(瀚源)  Supplier Part: C41430893  Supplier: LCSC  LCSC Part Name: 热插拔底座连接器 键盘配件  Footprint: ProPrj_HTX-easyedapro:SMD_KEYBOARD-SW  [SMD_KEYBOARD-SW]  (hidden comment: CPG151101S11-16)
U177  Manufacturer: HanElectricity(瀚源)  Supplier Part: C41430893  Supplier: LCSC  LCSC Part Name: 热插拔底座连接器 键盘配件  Footprint: ProPrj_HTX-easyedapro:SMD_KEYBOARD-SW  [SMD_KEYBOARD-SW]  (hidden comment: CPG151101S11-16)
U178  Manufacturer: HanElectricity(瀚源)  Supplier Part: C41430893  Supplier: LCSC  LCSC Part Name: 热插拔底座连接器 键盘配件  Footprint: ProPrj_HTX-easyedapro:SMD_KEYBOARD-SW  [SMD_KEYBOARD-SW]  (hidden comment: CPG151101S11-16)
U179  Manufacturer: HanElectricity(瀚源)  Supplier Part: C41430893  Supplier: LCSC  LCSC Part Name: 热插拔底座连接器 键盘配件  Footprint: ProPrj_HTX-easyedapro:SMD_KEYBOARD-SW  [SMD_KEYBOARD-SW]  (hidden comment: CPG151101S11-16)
U180  Manufacturer: XINGLIGHT(成兴光)  Supplier Part: C5440693  Supplier: LCSC  Footprint: ProPrj_HTX-easyedapro:LED-SMD_4P-L3.5-W2.8-BR-1  [LED-SMD_4P-L3.5-W2.8-BR-1]  (hidden comment: XL-3528RGBC-WS2812B)
U181  Manufacturer: XINGLIGHT(成兴光)  Supplier Part: C5440693  Supplier: LCSC  Footprint: ProPrj_HTX-easyedapro:LED-SMD_4P-L3.5-W2.8-BR-1  [LED-SMD_4P-L3.5-W2.8-BR-1]  (hidden comment: XL-3528RGBC-WS2812B)
U182  Supplier Part: C9900003682  Supplier: LCSC  Footprint: ProPrj_HTX-easyedapro:LED-SMD_L3.2-W2.8_YO-WS2812B-3528  [LED-SMD_L3.2-W2.8_YO-WS2812B-3528]  (hidden comment: Yo-WS2812B-3528反贴雾状)
U183  Supplier Part: C9900003682  Supplier: LCSC  Footprint: ProPrj_HTX-easyedapro:LED-SMD_L3.2-W2.8_YO-WS2812B-3528  [LED-SMD_L3.2-W2.8_YO-WS2812B-3528]  (hidden comment: Yo-WS2812B-3528反贴雾状)
U184  Supplier Part: C9900003682  Supplier: LCSC  Footprint: ProPrj_HTX-easyedapro:LED-SMD_L3.2-W2.8_YO-WS2812B-3528  [LED-SMD_L3.2-W2.8_YO-WS2812B-3528]  (hidden comment: Yo-WS2812B-3528反贴雾状)
U185  Supplier Part: C9900003682  Supplier: LCSC  Footprint: ProPrj_HTX-easyedapro:LED-SMD_L3.2-W2.8_YO-WS2812B-3528  [LED-SMD_L3.2-W2.8_YO-WS2812B-3528]  (hidden comment: Yo-WS2812B-3528反贴雾状)
U186  Supplier Part: C9900003682  Supplier: LCSC  Footprint: ProPrj_HTX-easyedapro:LED-SMD_L3.2-W2.8_YO-WS2812B-3528  [LED-SMD_L3.2-W2.8_YO-WS2812B-3528]  (hidden comment: Yo-WS2812B-3528反贴雾状)
U187  Supplier Part: C9900003682  Supplier: LCSC  Footprint: ProPrj_HTX-easyedapro:LED-SMD_L3.2-W2.8_YO-WS2812B-3528  [LED-SMD_L3.2-W2.8_YO-WS2812B-3528]  (hidden comment: Yo-WS2812B-3528反贴雾状)
U188  Supplier Part: C9900003682  Supplier: LCSC  Footprint: ProPrj_HTX-easyedapro:LED-SMD_L3.2-W2.8_YO-WS2812B-3528  [LED-SMD_L3.2-W2.8_YO-WS2812B-3528]  (hidden comment: Yo-WS2812B-3528反贴雾状)
U189  Supplier Part: C9900003682  Supplier: LCSC  Footprint: ProPrj_HTX-easyedapro:LED-SMD_L3.2-W2.8_YO-WS2812B-3528  [LED-SMD_L3.2-W2.8_YO-WS2812B-3528]  (hidden comment: Yo-WS2812B-3528反贴雾状)
U190  Manufacturer: HanElectricity(瀚源)  Supplier Part: C41430893  Supplier: LCSC  LCSC Part Name: 热插拔底座连接器 键盘配件  Footprint: ProPrj_HTX-easyedapro:SMD_KEYBOARD-SW  [SMD_KEYBOARD-SW]  (hidden comment: CPG151101S11-16)
U191  Manufacturer: HanElectricity(瀚源)  Supplier Part: C41430893  Supplier: LCSC  LCSC Part Name: 热插拔底座连接器 键盘配件  Footprint: ProPrj_HTX-easyedapro:SMD_KEYBOARD-SW  [SMD_KEYBOARD-SW]  (hidden comment: CPG151101S11-16)
U192  Manufacturer: HanElectricity(瀚源)  Supplier Part: C41430893  Supplier: LCSC  LCSC Part Name: 热插拔底座连接器 键盘配件  Footprint: ProPrj_HTX-easyedapro:SMD_KEYBOARD-SW  [SMD_KEYBOARD-SW]  (hidden comment: CPG151101S11-16)
U193  Manufacturer: HanElectricity(瀚源)  Supplier Part: C41430893  Supplier: LCSC  LCSC Part Name: 热插拔底座连接器 键盘配件  Footprint: ProPrj_HTX-easyedapro:SMD_KEYBOARD-SW  [SMD_KEYBOARD-SW]  (hidden comment: CPG151101S11-16)
U194  Manufacturer: HanElectricity(瀚源)  Supplier Part: C41430893  Supplier: LCSC  LCSC Part Name: 热插拔底座连接器 键盘配件  Footprint: ProPrj_HTX-easyedapro:SMD_KEYBOARD-SW  [SMD_KEYBOARD-SW]  (hidden comment: CPG151101S11-16)
U195  Manufacturer: HanElectricity(瀚源)  Supplier Part: C41430893  Supplier: LCSC  LCSC Part Name: 热插拔底座连接器 键盘配件  Footprint: ProPrj_HTX-easyedapro:SMD_KEYBOARD-SW  [SMD_KEYBOARD-SW]  (hidden comment: CPG151101S11-16)
U196  Manufacturer: HanElectricity(瀚源)  Supplier Part: C41430893  Supplier: LCSC  LCSC Part Name: 热插拔底座连接器 键盘配件  Footprint: ProPrj_HTX-easyedapro:SMD_KEYBOARD-SW  [SMD_KEYBOARD-SW]  (hidden comment: CPG151101S11-16)
U197  Manufacturer: HanElectricity(瀚源)  Supplier Part: C41430893  Supplier: LCSC  LCSC Part Name: 热插拔底座连接器 键盘配件  Footprint: ProPrj_HTX-easyedapro:SMD_KEYBOARD-SW  [SMD_KEYBOARD-SW]  (hidden comment: CPG151101S11-16)
U198  Supplier Part: C9900003682  Supplier: LCSC  Footprint: ProPrj_HTX-easyedapro:LED-SMD_L3.2-W2.8_YO-WS2812B-3528  [LED-SMD_L3.2-W2.8_YO-WS2812B-3528]  (hidden comment: Yo-WS2812B-3528反贴雾状)
U199  Supplier Part: C9900003682  Supplier: LCSC  Footprint: ProPrj_HTX-easyedapro:LED-SMD_L3.2-W2.8_YO-WS2812B-3528  [LED-SMD_L3.2-W2.8_YO-WS2812B-3528]  (hidden comment: Yo-WS2812B-3528反贴雾状)
U200  Supplier Part: C9900003682  Supplier: LCSC  Footprint: ProPrj_HTX-easyedapro:LED-SMD_L3.2-W2.8_YO-WS2812B-3528  [LED-SMD_L3.2-W2.8_YO-WS2812B-3528]  (hidden comment: Yo-WS2812B-3528反贴雾状)
U201  Supplier Part: C9900003682  Supplier: LCSC  Footprint: ProPrj_HTX-easyedapro:LED-SMD_L3.2-W2.8_YO-WS2812B-3528  [LED-SMD_L3.2-W2.8_YO-WS2812B-3528]  (hidden comment: Yo-WS2812B-3528反贴雾状)
U202  Supplier Part: C9900003682  Supplier: LCSC  Footprint: ProPrj_HTX-easyedapro:LED-SMD_L3.2-W2.8_YO-WS2812B-3528  [LED-SMD_L3.2-W2.8_YO-WS2812B-3528]  (hidden comment: Yo-WS2812B-3528反贴雾状)
U203  Supplier Part: C9900003682  Supplier: LCSC  Footprint: ProPrj_HTX-easyedapro:LED-SMD_L3.2-W2.8_YO-WS2812B-3528  [LED-SMD_L3.2-W2.8_YO-WS2812B-3528]  (hidden comment: Yo-WS2812B-3528反贴雾状)
U204  Supplier Part: C9900003682  Supplier: LCSC  Footprint: ProPrj_HTX-easyedapro:LED-SMD_L3.2-W2.8_YO-WS2812B-3528  [LED-SMD_L3.2-W2.8_YO-WS2812B-3528]  (hidden comment: Yo-WS2812B-3528反贴雾状)
U205  Supplier Part: C9900003682  Supplier: LCSC  Footprint: ProPrj_HTX-easyedapro:LED-SMD_L3.2-W2.8_YO-WS2812B-3528  [LED-SMD_L3.2-W2.8_YO-WS2812B-3528]  (hidden comment: Yo-WS2812B-3528反贴雾状)
U206  Supplier Part: C9900003682  Supplier: LCSC  Footprint: ProPrj_HTX-easyedapro:LED-SMD_L3.2-W2.8_YO-WS2812B-3528  [LED-SMD_L3.2-W2.8_YO-WS2812B-3528]  (hidden comment: Yo-WS2812B-3528反贴雾状)
U207  Manufacturer: HanElectricity(瀚源)  Supplier Part: C41430893  Supplier: LCSC  LCSC Part Name: 热插拔底座连接器 键盘配件  Footprint: ProPrj_HTX-easyedapro:SMD_KEYBOARD-SW  [SMD_KEYBOARD-SW]  (hidden comment: CPG151101S11-16)
U208  Manufacturer: HanElectricity(瀚源)  Supplier Part: C41430893  Supplier: LCSC  LCSC Part Name: 热插拔底座连接器 键盘配件  Footprint: ProPrj_HTX-easyedapro:SMD_KEYBOARD-SW  [SMD_KEYBOARD-SW]  (hidden comment: CPG151101S11-16)
U209  Manufacturer: HanElectricity(瀚源)  Supplier Part: C41430893  Supplier: LCSC  LCSC Part Name: 热插拔底座连接器 键盘配件  Footprint: ProPrj_HTX-easyedapro:SMD_KEYBOARD-SW  [SMD_KEYBOARD-SW]  (hidden comment: CPG151101S11-16)
U210  Manufacturer: HanElectricity(瀚源)  Supplier Part: C41430893  Supplier: LCSC  LCSC Part Name: 热插拔底座连接器 键盘配件  Footprint: ProPrj_HTX-easyedapro:SMD_KEYBOARD-SW  [SMD_KEYBOARD-SW]  (hidden comment: CPG151101S11-16)
U211  Manufacturer: HanElectricity(瀚源)  Supplier Part: C41430893  Supplier: LCSC  LCSC Part Name: 热插拔底座连接器 键盘配件  Footprint: ProPrj_HTX-easyedapro:SMD_KEYBOARD-SW  [SMD_KEYBOARD-SW]  (hidden comment: CPG151101S11-16)
U212  Manufacturer: HanElectricity(瀚源)  Supplier Part: C41430893  Supplier: LCSC  LCSC Part Name: 热插拔底座连接器 键盘配件  Footprint: ProPrj_HTX-easyedapro:SMD_KEYBOARD-SW  [SMD_KEYBOARD-SW]  (hidden comment: CPG151101S11-16)
U213  Manufacturer: HanElectricity(瀚源)  Supplier Part: C41430893  Supplier: LCSC  LCSC Part Name: 热插拔底座连接器 键盘配件  Footprint: ProPrj_HTX-easyedapro:SMD_KEYBOARD-SW  [SMD_KEYBOARD-SW]  (hidden comment: CPG151101S11-16)
U214  Manufacturer: HanElectricity(瀚源)  Supplier Part: C41430893  Supplier: LCSC  LCSC Part Name: 热插拔底座连接器 键盘配件  Footprint: ProPrj_HTX-easyedapro:SMD_KEYBOARD-SW  [SMD_KEYBOARD-SW]  (hidden comment: CPG151101S11-16)
U215  Manufacturer: HanElectricity(瀚源)  Supplier Part: C41430893  Supplier: LCSC  LCSC Part Name: 热插拔底座连接器 键盘配件  Footprint: ProPrj_HTX-easyedapro:SMD_KEYBOARD-SW  [SMD_KEYBOARD-SW]  (hidden comment: CPG151101S11-16)

### Ports
COL1 (in), COL2 (in), COL3 (in), COL4 (in), COL5 (in), COL6 (in), COL7 (in), COL8 (in), COL9 (in), COL10 (in), COL11 (in), COL12 (in), COL13 (in), COL14 (in), ROW1 (in), ROW2 (in), ROW3 (in), ROW4 (in), ROW5 (in), WS2812_1 (in), WS2812_2 (in, see [5B]), WS2812_2 (out, see [1B]), WS2812_3 (in, see [5B]), WS2812_3 (out, see [1B]), WS2812_4 (in, see [5B]), WS2812_4 (out, see [1C]), WS2812_5 (in, see [5C]), WS2812_5 (out, see [1C])